# EAGLE design BTM7752 (EAGLE 7.2.0)
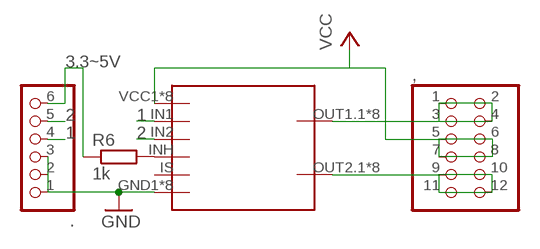
[diagram p0: schematic, sheet 1]

## Parts
,  PINHD-2X6  [2X06]
.  PINHD-1X6  [1X06]
R6  1k  R-EU_R0603  [R0603]
U$1  BTM7752  [BTM7752]

## Nets
1: ..4 U$1.IN1
2: ..5 U$1.IN2
3.3~5V: ..6 R6.1
GND: ..1 ..2 ..3 U$1.GND1(GND) U$1.GND2(GND) U$1.GND3(GND) U$1.GND4(GND) U$1.GND5(GND) U$1.GND6(GND) U$1.GND7(GND) U$1.GND8(GND)
N$1: ,.9 ,.10 ,.11 ,.12 U$1.OUT2.1(OUT2) U$1.OUT2.2(OUT2) U$1.OUT2.3(OUT2) U$1.OUT2.4(OUT2) U$1.OUT2.5(OUT2) U$1.OUT2.6(OUT2) U$1.OUT2.7(OUT2) U$1.OUT2.8(OUT2)
N$4: ,.1 ,.2 ,.3 ,.4 U$1.OUT1.1(OUT1) U$1.OUT1.2(OUT1) U$1.OUT1.3(OUT1) U$1.OUT1.4(OUT1) U$1.OUT1.5(OUT1) U$1.OUT1.6(OUT1) U$1.OUT1.7(OUT1) U$1.OUT1.8(OUT1)
N$6: R6.2 U$1.INH
VCC: ,.5 ,.6 ,.7 ,.8 U$1.VCC1(VCC) U$1.VCC2(VCC) U$1.VCC3(VCC) U$1.VCC4(VCC) U$1.VCC5(VCC) U$1.VCC6(VCC) U$1.VCC7(VCC) U$1.VCC8(VCC)
Unconnected: U$1.IS

## Library data of the parts
, = pinhead:PINHD-2X6: PIN HEADER
. = pinhead:PINHD-1X6: PIN HEADER
R6 = rcl:R-EU_: RESISTOR, European symbol
U$1 = BTM7752:BTM7752

## Board
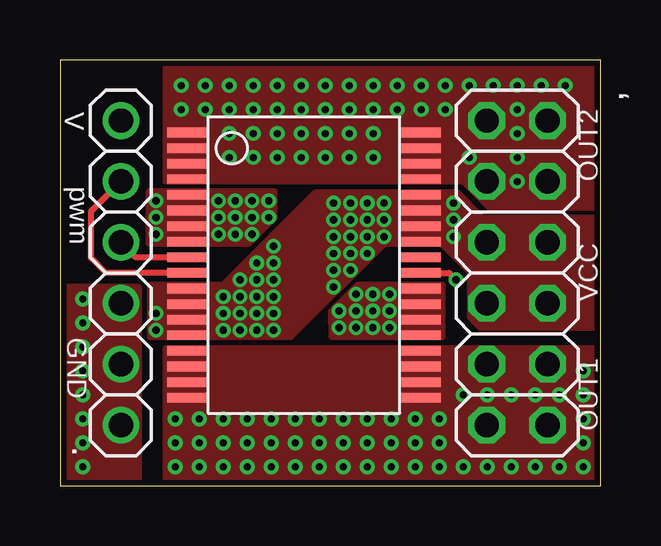
[diagram p1: board, top side]
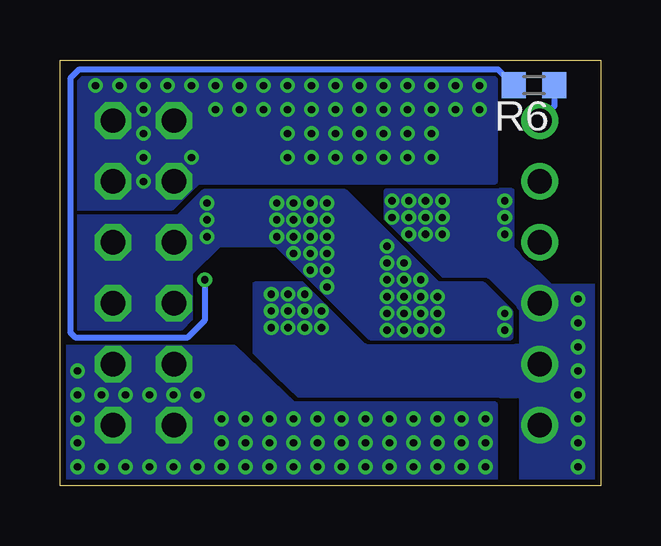
[diagram p2: board, bottom side, seen from below]

Size 22.53 x 17.77 mm. Coordinates in mm from the lower left corner, seen from the top.
Outline: 0,0 22.53,0 22.53,17.77 0,17.77 0,0
Copper layers (1*16): Top 0.035mm / dielectric 1.5mm / Bottom 0.035mm
Design rules "default *": minimum track width 6mil, minimum drill 12mil, track to track 6mil, track to pad 6mil, pad to pad 6mil, via to via 6mil, smd to smd 6mil, copper to edge 10mil, drill to drill 10mil, minimum pad ring 6mil, minimum via ring 6mil, stop-mask expansion 2mil, vias tented up to drill 25mil, thermal gap 10mil

### Footprints (pad centres in the part's own frame; a part is rotated, then mirrored left to right if it is on the bottom)
2X06 = drill 1.016 octagon: 1 -6.35,-1.27; 2 -6.35,1.27; 3 -3.81,-1.27; 4 -3.81,1.27; 5 -1.27,-1.27; 6 -1.27,1.27; 7 1.27,-1.27; 8 1.27,1.27; 9 3.81,-1.27; 10 3.81,1.27; 11 6.35,-1.27; 12 6.35,1.27
1X06 = drill 1.016: 1 -6.35,0; 2 -3.81,0; 3 -1.27,0; 4 1.27,0; 5 3.81,0; 6 6.35,0
R0603 = smd 1 x 1.1: 1 -0.85,0; 2 0.85,0
BTM7752 = smd 1.67 x 0.4: GND1 -4.86,3.25; GND2 -4.86,2.6; GND3 -4.86,1.95; GND4 -4.86,1.3; GND5 4.86,-0.65; GND6 4.86,-1.3; GND7 4.86,-1.95; GND8 4.86,-2.6; IN1 -4.86,0.65; IN2 -4.86,0; INH 4.86,0; IS 4.86,0.65; OUT1.1 -4.86,5.85; OUT1.2 -4.86,5.2; OUT1.3 -4.86,4.55; OUT1.4 -4.86,3.9; OUT1.5 4.86,5.85; OUT1.6 4.86,5.2; OUT1.7 4.86,4.55; OUT1.8 4.86,3.9; OUT2.1 -4.86,-3.25; OUT2.2 -4.86,-3.9; OUT2.3 -4.86,-4.55; OUT2.4 -4.86,-5.2; OUT2.5 4.86,-3.25; OUT2.6 4.86,-3.9; OUT2.7 4.86,-4.55; OUT2.8 4.86,-5.2; VCC1 -4.86,-0.65; VCC2 -4.86,-1.3; VCC3 -4.86,-1.95; VCC4 -4.86,-2.6; VCC5 4.86,3.25; VCC6 4.86,2.6; VCC7 4.86,1.95; VCC8 4.86,1.3

### Placement (x,y rotation side)
,  19.05,8.89 270 top
.  2.54,8.89 90 top
R6  2.78,16.72 180 bottom
U$1  10.16,8.89 0 top

### Tracks (layer width: path | path; a pad name or v marks a point on that pad's centre or on a via)
1
  Top 0.254: U$1.IN1 3.16,9.54 ..4
2
  Top 0.254: U$1.IN2 1.91,8.89 1.3,9.5 1.3,11.46 ..5
3.3~5V
  Bottom 0.254: R6.1 1.93,15.85 ..6
GND  (via drill 0.3)
  other vias: 13.73,8 13.73,7.3 13.73,6.6 4,11.2 4,10.5 4,11.9 6.6,11.9 6.6,11.2 6.6,10.5 7.3,11.9 7.3,11.2 7.3,10.5 8,11.9 8,11.2 8,10.5 8.7,11.9 8.7,11.2 13.03,8 13.03,7.3 13.03,6.6 12.33,6.6 12.33,7.3 12.33,8 11.63,7.3 11.63,6.6 0.95,7.8 0.95,6.8 0.95,5.8 0.95,4.8 0.95,3.8 0.95,2.8 0.95,1.8 0.95,0.8
  pour Top (no thermals): 12.4,8.4 15.93,8.4 15.93,6.2 11.33,6.2 11.3,7.3
  pour Top (rank 6, no thermals): 3.7,12.3 8.93,12.3 8.93,11.1 7.93,10.1 3.7,10.1
  pour Bottom (no thermals): -1,8.3 3.3,8.3 3.3,-1 -1,-1
  pour Bottom (rank 6, no thermals): 3.7,12.3 8.93,12.3 8.93,11.1 6.6,8.8 4.7,8.8 3,7.1 1.8,7.1 1.8,8 3.7,9.9
  pour Bottom (rank 6, no thermals): 14.4,8.4 14.4,5.6 12.6,3.8 1.4,3.8 1.4,5.6 1.4,5.8 9.7,5.8 9.8,5.8 12.4,8.4
  pour Top (rank 6, no thermals): 3.3,8.3 -0.5,8.3 -0.5,-0.5 3.3,-0.5
N$1  (via drill 0.3)
  other vias: 4.8,0.8 4.8,1.8 4.8,2.8 5.8,2.8 5.8,1.8 5.8,0.8 6.8,0.8 7.8,1.8 6.8,1.8 6.8,2.8 7.8,2.8 7.8,0.8 8.8,0.8 8.8,1.8 8.8,2.8 9.8,2.8 9.8,1.8 9.8,0.8 10.8,0.8 10.8,1.8 10.8,2.8 11.8,2.8 11.8,1.8 11.8,0.8 12.8,0.8 12.8,1.8 12.8,2.8 13.8,2.8 13.8,1.8 13.8,0.8 14.8,0.8 14.8,1.8 14.8,2.8 15.8,2.8 15.8,1.8 15.8,0.8 16.8,0.8 17.8,0.8 18.8,0.8 19.8,0.8 20.8,0.8 21.8,0.8 21.8,1.8 21.8,2.8 21.8,3.8 21.8,4.8 20.8,3.8 19.8,3.8 18.8,3.8 17.8,3.8 16.8,3.8
  pour Top (no thermals): 4.4,5.75 23,5.75 23,-0.5 4.4,-0.5
  pour Bottom (no thermals): 4.4,3.4 12.8,3.4 15.25,5.75 23.5,5.75 23.5,-1 4.4,-1
N$4  (via drill 0.3)
  other vias: 19.05,14.7 5.05,16.7 5.05,15.7 6.05,15.7 6.05,16.7 7.05,16.7 7.05,15.7 7.05,14.7 7.05,13.7 8.05,13.7 8.05,14.7 8.05,15.7 8.05,16.7 9.05,16.7 9.05,15.7 9.05,14.7 9.05,13.7 10.05,13.7 10.05,14.7 10.05,15.7 10.05,16.7 11.05,16.7 11.05,15.7 11.05,14.7 11.05,13.7 12.05,13.7 12.05,14.7 12.05,15.7 12.05,16.7 13.05,16.7 13.05,15.7 13.05,14.7 13.05,13.7 14.05,15.7 14.05,16.7 15.05,16.7 15.05,15.7 16.05,16.7 16.05,15.7 17.05,16.7 18.05,16.7 19.05,16.7 20.05,16.7 21.05,16.7 19.05,15.7 19.05,13.7 19.05,12.7 17.05,13.7
  pour Bottom (rank 3, no thermals): 4.4,12.7 4.4,18.7 23.5,18.7 23.5,11.6 17.9,11.6 16.8,12.7
  pour Top (rank 3, no thermals): 4.4,12.7 4.4,18.2 23,18.2 23,11.6 17.9,11.6 16.8,12.7
N$6  (via drill 0.3)
  Top 0.254: U$1.INH 16.21,8.89 v16.5,8.6
  Bottom 0.254: v16.5,8.6 16.5,6.9 17.2,6.2 21.9,6.2 22.1,6.4 22.1,17 21.72,17.38 4.29,17.38 R6.2
VCC  (via drill 0.3)
  other vias: 4,7.2 4,6.5 6.8,7.2 6.8,6.5 6.8,7.9 7.5,7.9 7.5,7.2 7.5,6.5 8.2,6.5 8.2,7.2 8.2,7.9 8.2,8.6 7.5,8.6 8.2,9.3 8.9,10 8.9,9.3 8.9,8.6 8.9,7.9 8.9,7.2 8.9,6.5 16.4,11.8 16.4,11.1 16.4,10.4 13.5,11.8 13.5,11.1 13.5,10.4 12.8,11.8 12.8,11.1 12.8,10.4 12.8,9.7 12.1,11.8 11.4,11.8 12.1,11.1 11.4,11.1 11.4,10.4 12.1,10.4 12.1,9.7 11.4,9.7 11.4,9 12.1,9 11.4,8.3
  pour Top (no thermals): 3.75,8.4 6.8,8.4 10.65,12.25 16.55,12.25 17.6,11.2 23,11.2 23,6.6 17.5,6.6 17.1,7 17.1,8.9 15.9,10.1 13.5,10.1 9.6,6.2 3.75,6.2
  pour Bottom (no thermals): 3.75,6.2 3.75,7.25 4.9,8.4 6.8,8.4 10.65,12.25 16.55,12.25 17.6,11.2 23.5,11.2 23.5,6.6 17.5,6.6 17.1,7 17.1,8.9 15.9,10.1 13.5,10.1 9.6,6.2

### Text on the board
tPlace: V | OUT2 | pwm | VCC | GND | OUT1